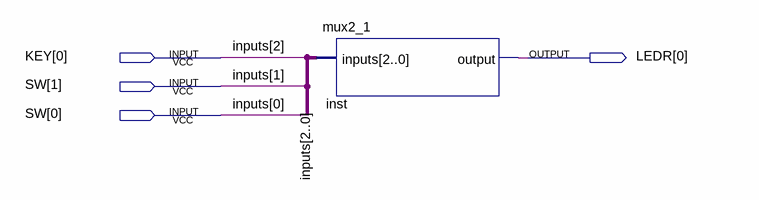
[diagram p0: schematic sheet]
// Quartus schematic Mux2_1Demo.bdf as structural Verilog: 1 symbols, 4 pins
module Mux2_1Demo (
  input  [0:0] KEY,
  input  [1:0] SW,
  output [0:0] LEDR
);

  mux2_1 inst (.inputs({KEY[0], SW}), .\output (LEDR[0]));

  // Other names for the same wires on the sheet: inputs[2:0] = {KEY[0], SW}
endmodule
